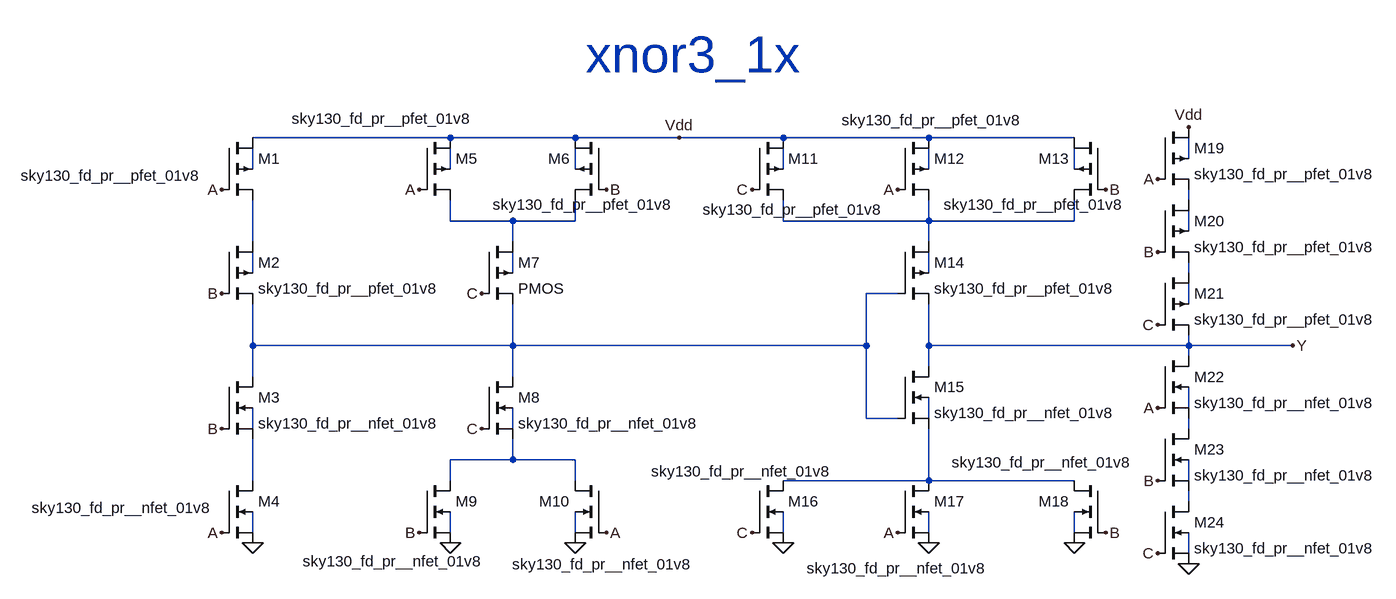
[diagram p0: schematic xnor3_1x.asc]
xnor3_1x.asc, the LTspice schematic file:
Version 4
SHEET 1 1216 748
WIRE -240 48 -544 48
WIRE -48 48 -240 48
WIRE 112 48 -48 48
WIRE 272 48 112 48
WIRE 496 48 272 48
WIRE 720 48 496 48
WIRE 896 80 896 48
WIRE -544 96 -544 64
WIRE -240 96 -240 64
WIRE -48 96 -48 64
WIRE 272 96 272 64
WIRE 496 96 496 64
WIRE 720 96 720 64
WIRE 896 144 896 128
WIRE -240 176 -240 144
WIRE -144 176 -240 176
WIRE -48 176 -48 144
WIRE -48 176 -144 176
WIRE 272 176 272 144
WIRE 496 176 496 144
WIRE 496 176 272 176
WIRE 720 176 720 144
WIRE 720 176 496 176
WIRE 896 192 896 160
WIRE -544 208 -544 144
WIRE -144 208 -144 176
WIRE 496 208 496 176
WIRE -544 256 -544 224
WIRE -144 256 -144 224
WIRE 496 256 496 224
WIRE 896 256 896 240
WIRE 448 288 400 288
WIRE 896 304 896 272
WIRE -544 368 -544 304
WIRE -144 368 -144 304
WIRE -144 368 -544 368
WIRE 400 368 400 288
WIRE 400 368 -144 368
WIRE 496 368 496 304
WIRE 896 368 896 352
WIRE 896 368 496 368
WIRE 1056 368 896 368
WIRE 896 384 896 368
WIRE 496 400 496 368
WIRE -544 416 -544 368
WIRE -144 416 -144 368
WIRE 896 464 896 432
WIRE 400 480 400 368
WIRE 448 480 400 480
WIRE 496 480 496 448
WIRE -544 496 -544 464
WIRE -144 496 -144 464
WIRE 896 496 896 480
WIRE -144 544 -144 512
WIRE -144 544 -240 544
WIRE -48 544 -144 544
WIRE -544 576 -544 512
WIRE -240 576 -240 544
WIRE -48 576 -48 544
WIRE 496 576 496 496
WIRE 496 576 272 576
WIRE 720 576 496 576
WIRE 896 576 896 544
WIRE 896 608 896 592
WIRE -544 656 -544 624
WIRE -240 656 -240 624
WIRE -48 656 -48 624
WIRE 272 656 272 624
WIRE 496 656 496 624
WIRE 720 656 720 624
WIRE 896 688 896 656
FLAG -544 672 0
FLAG -240 672 0
FLAG -48 672 0
FLAG 272 672 0
FLAG 496 672 0
FLAG 720 672 0
FLAG 896 704 0
FLAG 112 48 Vdd
FLAG 896 32 Vdd
FLAG -592 128 A
FLAG -288 128 A
FLAG -592 288 B
FLAG 0 128 B
FLAG -192 288 C
FLAG 224 128 C
FLAG 448 128 A
FLAG 768 128 B
FLAG -592 496 B
FLAG -192 496 C
FLAG -592 656 A
FLAG -288 656 B
FLAG 0 656 A
FLAG 448 656 A
FLAG 768 656 B
FLAG 224 656 C
FLAG 848 112 A
FLAG 848 224 B
FLAG 848 336 C
FLAG 848 464 A
FLAG 848 576 B
FLAG 848 688 C
FLAG 1056 368 Y
SYMBOL pmos4 -592 48 R0
WINDOW 3 -309 58 Left 2
SYMATTR InstName M1
SYMATTR Value2 l=0.13u w=4u
SYMATTR Value sky130_fd_pr__pfet_01v8
SYMBOL nmos4 -592 416 R0
SYMATTR InstName M3
SYMATTR Value2 l=0.13u w=2u
SYMATTR Value sky130_fd_pr__nfet_01v8
SYMBOL pmos4 -288 48 R0
WINDOW 3 -196 -29 Left 2
SYMATTR InstName M5
SYMATTR Value2 l=0.13u w=4u
SYMATTR Value sky130_fd_pr__pfet_01v8
SYMBOL pmos4 0 48 M0
WINDOW 3 -104 103 Left 2
SYMATTR InstName M6
SYMATTR Value2 l=0.13u w=4u
SYMATTR Value sky130_fd_pr__pfet_01v8
SYMBOL pmos4 -592 208 R0
SYMATTR InstName M2
SYMATTR Value2 l=0.13u w=4u
SYMATTR Value sky130_fd_pr__pfet_01v8
SYMBOL pmos4 -192 208 R0
SYMATTR InstName M7
SYMATTR Value2 l=0.13u w=4u
SYMBOL pmos4 224 48 R0
WINDOW 3 -76 111 Left 2
SYMATTR InstName M11
SYMATTR Value2 l=0.13u w=4u
SYMATTR Value sky130_fd_pr__pfet_01v8
SYMBOL pmos4 448 48 R0
WINDOW 3 -86 -27 Left 2
SYMATTR InstName M12
SYMATTR Value2 l=0.13u w=4u
SYMATTR Value sky130_fd_pr__pfet_01v8
SYMBOL pmos4 768 48 M0
WINDOW 3 -30 103 Left 2
SYMATTR InstName M13
SYMATTR Value2 l=0.13u w=4u
SYMATTR Value sky130_fd_pr__pfet_01v8
SYMBOL pmos4 448 208 R0
SYMATTR InstName M14
SYMATTR Value2 l=0.13u w=4u
SYMATTR Value sky130_fd_pr__pfet_01v8
SYMBOL nmos4 -192 416 R0
SYMATTR InstName M8
SYMATTR Value2 l=0.13u w=2u
SYMATTR Value sky130_fd_pr__nfet_01v8
SYMBOL nmos4 -592 576 R0
WINDOW 3 -292 42 Left 2
SYMATTR InstName M4
SYMATTR Value2 l=0.13u w=2u
SYMATTR Value sky130_fd_pr__nfet_01v8
SYMBOL nmos4 -288 576 R0
WINDOW 3 -179 124 Left 2
SYMATTR InstName M9
SYMATTR Value2 l=0.13u w=2u
SYMATTR Value sky130_fd_pr__nfet_01v8
SYMBOL nmos4 0 576 M0
WINDOW 3 -134 129 Left 2
SYMATTR InstName M10
SYMATTR Value2 l=0.13u w=2u
SYMATTR Value sky130_fd_pr__nfet_01v8
SYMBOL nmos4 448 400 R0
SYMATTR InstName M15
SYMATTR Value2 l=0.13u w=4u
SYMATTR Value sky130_fd_pr__nfet_01v8
SYMBOL nmos4 224 576 R0
WINDOW 3 -155 -14 Left 2
SYMATTR InstName M16
SYMATTR Value2 l=0.13u w=4u
SYMATTR Value sky130_fd_pr__nfet_01v8
SYMBOL nmos4 448 576 R0
WINDOW 3 -140 135 Left 2
SYMATTR InstName M17
SYMATTR Value2 l=0.13u w=4u
SYMATTR Value sky130_fd_pr__nfet_01v8
SYMBOL nmos4 768 576 M0
WINDOW 3 -42 -28 Left 2
SYMATTR InstName M18
SYMATTR Value2 l=0.13u w=4u
SYMATTR Value sky130_fd_pr__nfet_01v8
SYMBOL pmos4 848 32 R0
SYMATTR InstName M19
SYMATTR Value2 l=0.13u w=6u
SYMATTR Value sky130_fd_pr__pfet_01v8
SYMBOL pmos4 848 144 R0
SYMATTR InstName M20
SYMATTR Value2 l=0.13u w=6u
SYMATTR Value sky130_fd_pr__pfet_01v8
SYMBOL pmos4 848 256 R0
SYMATTR InstName M21
SYMATTR Value2 l=0.13u w=6u
SYMATTR Value sky130_fd_pr__pfet_01v8
SYMBOL nmos4 848 384 R0
SYMATTR InstName M22
SYMATTR Value2 l=0.13u w=3u
SYMATTR Value sky130_fd_pr__nfet_01v8
SYMBOL nmos4 848 496 R0
SYMATTR InstName M23
SYMATTR Value2 l=0.13u w=3u
SYMATTR Value sky130_fd_pr__nfet_01v8
SYMBOL nmos4 848 608 R0
SYMATTR InstName M24
SYMATTR Value2 l=0.13u w=3u
SYMATTR Value sky130_fd_pr__nfet_01v8
TEXT -32 -80 Left 6 ;xnor3_1x

The netlist it stands for:
* xnor3_1x.asc
M1 Vdd A N012 N002 sky130_fd_pr__pfet_01v8 l=0.13u w=4u
M3 N017 B N025 N021 sky130_fd_pr__nfet_01v8 l=0.13u w=2u
M5 Vdd A N009 N003 sky130_fd_pr__pfet_01v8 l=0.13u w=4u
M6 Vdd B N009 N004 sky130_fd_pr__pfet_01v8 l=0.13u w=4u
M2 N012 B N017 N013 sky130_fd_pr__pfet_01v8 l=0.13u w=4u
M7 N009 C N017 N014 PMOS l=0.13u w=4u
M11 Vdd C N010 N005 sky130_fd_pr__pfet_01v8 l=0.13u w=4u
M12 Vdd A N010 N006 sky130_fd_pr__pfet_01v8 l=0.13u w=4u
M13 Vdd B N010 N007 sky130_fd_pr__pfet_01v8 l=0.13u w=4u
M14 N010 N017 Y N015 sky130_fd_pr__pfet_01v8 l=0.13u w=4u
M8 N017 C N024 N022 sky130_fd_pr__nfet_01v8 l=0.13u w=2u
M4 N025 A 0 N029 sky130_fd_pr__nfet_01v8 l=0.13u w=2u
M9 N024 B 0 N030 sky130_fd_pr__nfet_01v8 l=0.13u w=2u
M10 N024 A 0 N031 sky130_fd_pr__nfet_01v8 l=0.13u w=2u
M15 Y N017 N026 N020 sky130_fd_pr__nfet_01v8 l=0.13u w=4u
M16 N026 C 0 N032 sky130_fd_pr__nfet_01v8 l=0.13u w=4u
M17 N026 A 0 N033 sky130_fd_pr__nfet_01v8 l=0.13u w=4u
M18 N026 B 0 N034 sky130_fd_pr__nfet_01v8 l=0.13u w=4u
M19 Vdd A N008 N001 sky130_fd_pr__pfet_01v8 l=0.13u w=6u
M20 N008 B N016 N011 sky130_fd_pr__pfet_01v8 l=0.13u w=6u
M21 N016 C Y N018 sky130_fd_pr__pfet_01v8 l=0.13u w=6u
M22 Y A N023 N019 sky130_fd_pr__nfet_01v8 l=0.13u w=3u
M23 N023 B N028 N027 sky130_fd_pr__nfet_01v8 l=0.13u w=3u
M24 N028 C 0 N035 sky130_fd_pr__nfet_01v8 l=0.13u w=3u
.model NMOS NMOS
.model PMOS PMOS
.lib standard.mos
* xnor3_1x
.backanno
.end